# Altium schematic sheet TYPE-C 16PIN L8.351_TYPE-C 16PIN L8.35.schdoc
size 124 x 99 mm
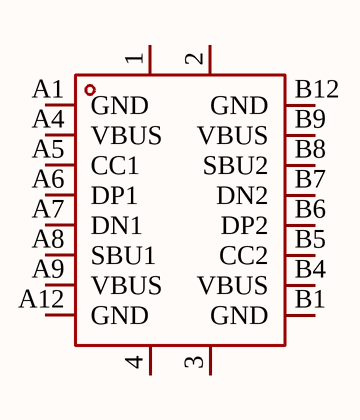
[diagram p0: TYPE-C 16PIN L8.351_TYPE-C 16PIN L8.35.schdoc]

## Parts
U?  TYPE-C 16PIN L8.35  [TYPE-C-SMD_20009-UCAF001-X]  (value not drawn)

## Nets

Not connected (* = marked no-connect by the designer): U? 1 2 3 4 A1(GND) A4(VBUS) A5(CC1) A6(DP1) A7(DN1) A8(SBU1) A9(VBUS) A12(GND) B1(GND) B4(VBUS) B5(CC2) B6(DP2) B7(DN2) B8(SBU2) B9(VBUS) B12(GND)

## Library data of the parts
U? = TYPE-C 16PIN L8.35: Manufacturer: SHOU HAN(首韩); Add into BOM: yes; Gender: Female; Number of Contacts: 16P; Number of Ports: 1; Current Rating - Power (Max): 3A; Rated Voltage (Max): 20V; Connect-Disconnect Life: 10,000 times; Core Colour: Black; Symbol: TYPE-C 16PIN L8.35; Device: TYPE-C 16PIN L8.35; LCSC Part Name: Type-C 母 卧贴; Supplier Part: C5379909; Manufacturer Part: TYPE-C 16PIN L8.35; Supplier Footprint: SMD; JLCPCB Part Class: Extended Part; Datasheet: https://atta.szlcsc.com/upload/public/pdf/source/20230323/07842B1540AE5591E723CD0E16AEF241.pdf; Supplier: LCSC; Convert to PCB: yes; Connector Type: Type-C; Standard: USB 3.1; Mounting Style: Horizontal attachment; Operating Temperature Range: -25℃~+85℃